# Altium schematic sheet układ.SchDoc: param:Title
size A4; Author: param:Autor; Wersja: param:Wersja
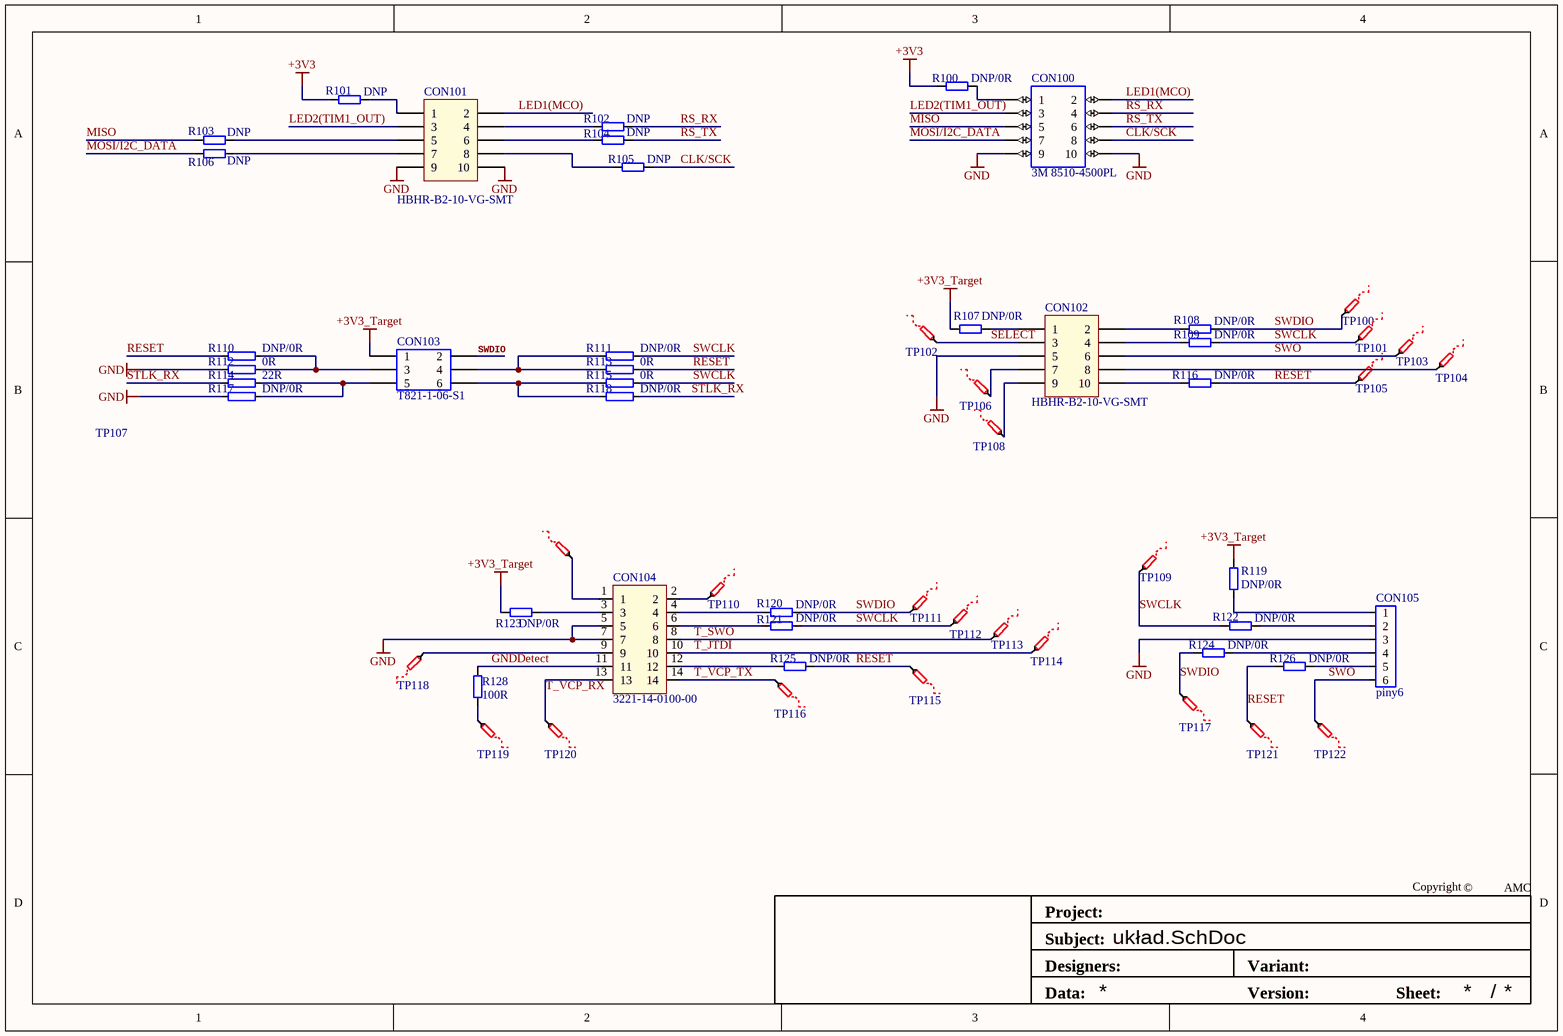
[diagram p0: układ.SchDoc]

## Parts
CON100  3M 8510-4500PL  [PINY2X5 zenskie]
CON101  HBHR-B2-10-VG-SMT  [piny_1k27_2x5_smd_IDC]
CON102  HBHR-B2-10-VG-SMT  [piny_1k27_2x5_smd_IDC]
CON103  T821-1-06-S1  [IDC_2X3_2.54MM]
CON104  3221-14-0100-00  [PINY_2X7_1.27_THT]
CON105  piny6  [piny1x6]
R100  DNP/0R  [0603]
R101  DNP  [0805]
R102  DNP  [0603]
R103  DNP  [0603]
R104  DNP  [0603]
R105  DNP  [0603]
R106  DNP  [0603]
R107  DNP/0R  [0603]
R108  DNP/0R  [0603]
R109  DNP/0R  [0603]
R110  DNP/0R  [0603]
R111  DNP/0R  [0603]
R112  0R  [0603]
R113  0R  [0603]
R114  22R  [0603]
R115  0R  [0603]
R116  DNP/0R  [0603]
R117  DNP/0R  [0603]
R118  DNP/0R  [0603]
R119  DNP/0R  [0603]
R120  DNP/0R  [0603]
R121  DNP/0R  [0603]
R122  DNP/0R  [0603]
R123  DNP/0R  [0603]
R124  DNP/0R  [0603]
R125  DNP/0R  [0603]
R126  DNP/0R  [0603]
R128  100R  [0603]
TP100  testpoint  [testpoint_50mils_octagonal]  (value not drawn)
TP101  testpoint  [testpoint_50mils_octagonal]  (value not drawn)
TP102  testpoint  [testpoint_50mils_octagonal]  (value not drawn)
TP103  testpoint  [testpoint_50mils_octagonal]  (value not drawn)
TP104  testpoint  [testpoint_50mils_octagonal]  (value not drawn)
TP105  testpoint  [testpoint_50mils_octagonal]  (value not drawn)
TP106  testpoint  [testpoint_50mils_octagonal]  (value not drawn)
TP107  testpoint  [testpoint_50mils_octagonal]  (value not drawn)
TP108  testpoint  [testpoint_50mils_octagonal]  (value not drawn)
TP109  testpoint  [testpoint_50mils_octagonal]  (value not drawn)
TP110  testpoint  [testpoint_50mils_octagonal]  (value not drawn)
TP111  testpoint  [testpoint_50mils_octagonal]  (value not drawn)
TP112  testpoint  [testpoint_50mils_octagonal]  (value not drawn)
TP113  testpoint  [testpoint_50mils_octagonal]  (value not drawn)
TP114  testpoint  [testpoint_50mils_octagonal]  (value not drawn)
TP115  testpoint  [testpoint_50mils_octagonal]  (value not drawn)
TP116  testpoint  [testpoint_50mils_octagonal]  (value not drawn)
TP117  testpoint  [testpoint_50mils_octagonal]  (value not drawn)
TP118  testpoint  [testpoint_50mils_octagonal]  (value not drawn)
TP119  testpoint  [testpoint_50mils_octagonal]  (value not drawn)
TP120  testpoint  [testpoint_50mils_octagonal]  (value not drawn)
TP121  testpoint  [testpoint_50mils_octagonal]  (value not drawn)
TP122  testpoint  [testpoint_50mils_octagonal]  (value not drawn)

## Nets
+3V3: R100.1 R101.1
+3V3_Target: CON103.1 R107.1 R119.2 R123.2
GND: CON100.9 CON100.10 CON101.9 CON101.10 CON102.5 CON104.5 CON104.7 CON105.3 R112.2 R117.2
CLK/SCK: CON100.8 R105.2
GNDDetect: CON104.11 R128.2
LED1(MCO): CON100.2 CON101.2
LED2(TIM1_OUT): CON100.3 CON101.3
MISO: CON100.5 R103.1
MOSI/I2C_DATA: CON100.7 R106.1
RESET: R110.2 R113.1 R116.2 R125.2 R126.1 TP105.1 TP115.1 TP121.1
RS_RX: CON100.4 R102.2
RS_TX: CON100.6 R104.2
SELECT: CON102.3 TP102.1
STLK_RX: R114.2 R118.1
SWCLK: R109.2 R111.1 R115.1 R121.2 R122.1 TP101.1 TP109.1 TP112.1
SWDIO: CON103.2 R108.2 R120.2 R124.1 TP100.1 TP111.1 TP117.1
SWO: CON102.6 CON105.6 TP103.1 TP122.1
T_JTDI: CON104.10 TP114.1
T_SWO: CON104.8 TP113.1
T_VCP_RX: CON104.13 TP120.1
T_VCP_TX: CON104.14 TP116.1
NetCON100_1: CON100.1 R100.2
NetCON101_1: CON101.1 R101.2
NetCON101_4: CON101.4 R102.1
NetCON101_5: CON101.5 R103.2
NetCON101_6: CON101.6 R104.1
NetCON101_7: CON101.7 R106.2
NetCON101_8: CON101.8 R105.1
NetCON102_1: CON102.1 R107.2
NetCON102_2: CON102.2 R108.1
NetCON102_4: CON102.4 R109.1
NetCON102_7: CON102.7 TP106.1
NetCON102_8: CON102.8 TP104.1
NetCON102_9: CON102.9 TP108.1
NetCON102_10: CON102.10 R116.1
NetCON103_3: CON103.3 R110.1 R112.1
NetCON103_4: CON103.4 R111.2 R113.2
NetCON103_5: CON103.5 R114.1 R117.1
NetCON103_6: CON103.6 R115.2 R118.2
NetCON104_1: CON104.1 TP107.1
NetCON104_2: CON104.2 TP110.1
NetCON104_3: CON104.3 R123.1
NetCON104_4: CON104.4 R120.1
NetCON104_6: CON104.6 R121.1
NetCON104_9: CON104.9 TP118.1
NetCON104_12: CON104.12 R125.1
NetCON105_1: CON105.1 R119.1
NetCON105_2: CON105.2 R122.2
NetCON105_4: CON105.4 R124.2
NetCON105_5: CON105.5 R126.2
NetR128_1: R128.1 TP119.1

## Notes on the sheet
- Project:
- Copyright
- ©
- AMC
- Designers:
- Subject:
- Variant:
- Data:
- Version:
- Sheet:
- /

## Library data of the parts
CON100 = piny_2x5 zenskie Petroster: Gniazdo; IDC; żeńskie; PIN: 10; proste; THT; złocony; 3A; 2,54mm
CON101 CON102 = AMC_Debug: AMC Debug connector / IDC 2x5 pitch 1.27
CON103 = piny_2x3: idc-pionowe: maritex: bh06s , tme: ZL231-6PG
CON104 = 3221-14-0100-00: CONN HEADER VERT 14POS 1.27MM
R100-R109 R116 R119-R126 R128 = rez_3k: Value: =Comments
R110-R115 R117 R118 = RES
  R110 R111 R117 R118: Value: DNP/0R
  R112 R113 R115: Value: 0R
  R114: Value: 22R